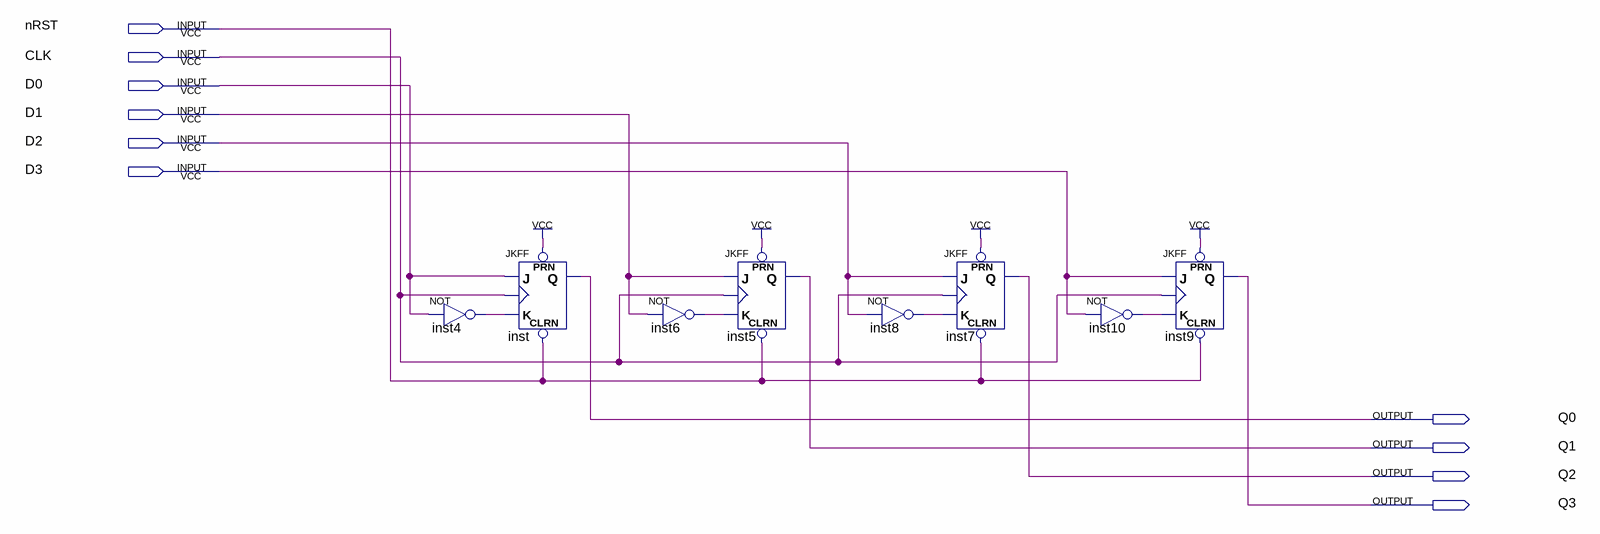
[diagram p0: schematic sheet]
// Quartus schematic Reg.bdf as structural Verilog: 8 symbols, 10 pins
module Reg (
  input  nRST,
  input  CLK,
  input  D0,
  input  D1,
  input  D2,
  input  D3,
  output Q0,
  output Q1,
  output Q2,
  output Q3
);

  wire inst4_out, inst6_out, inst8_out, inst10_out;

  not inst4 (inst4_out, D0);
  JKFF inst (.PRN(1'b1), .CLRN(nRST), .K(inst4_out), .J(D0), .CLK(CLK), .Q(Q0));
  not inst6 (inst6_out, D1);
  JKFF inst5 (.PRN(1'b1), .CLRN(nRST), .K(inst6_out), .J(D1), .CLK(CLK), .Q(Q1));
  not inst8 (inst8_out, D2);
  JKFF inst7 (.PRN(1'b1), .CLRN(nRST), .K(inst8_out), .J(D2), .CLK(CLK), .Q(Q2));
  not inst10 (inst10_out, D3);
  JKFF inst9 (.PRN(1'b1), .CLRN(nRST), .K(inst10_out), .J(D3), .CLK(CLK), .Q(Q3));
endmodule
